# Altium project Inverter_Control.PrjPcb (part 1 of 4)
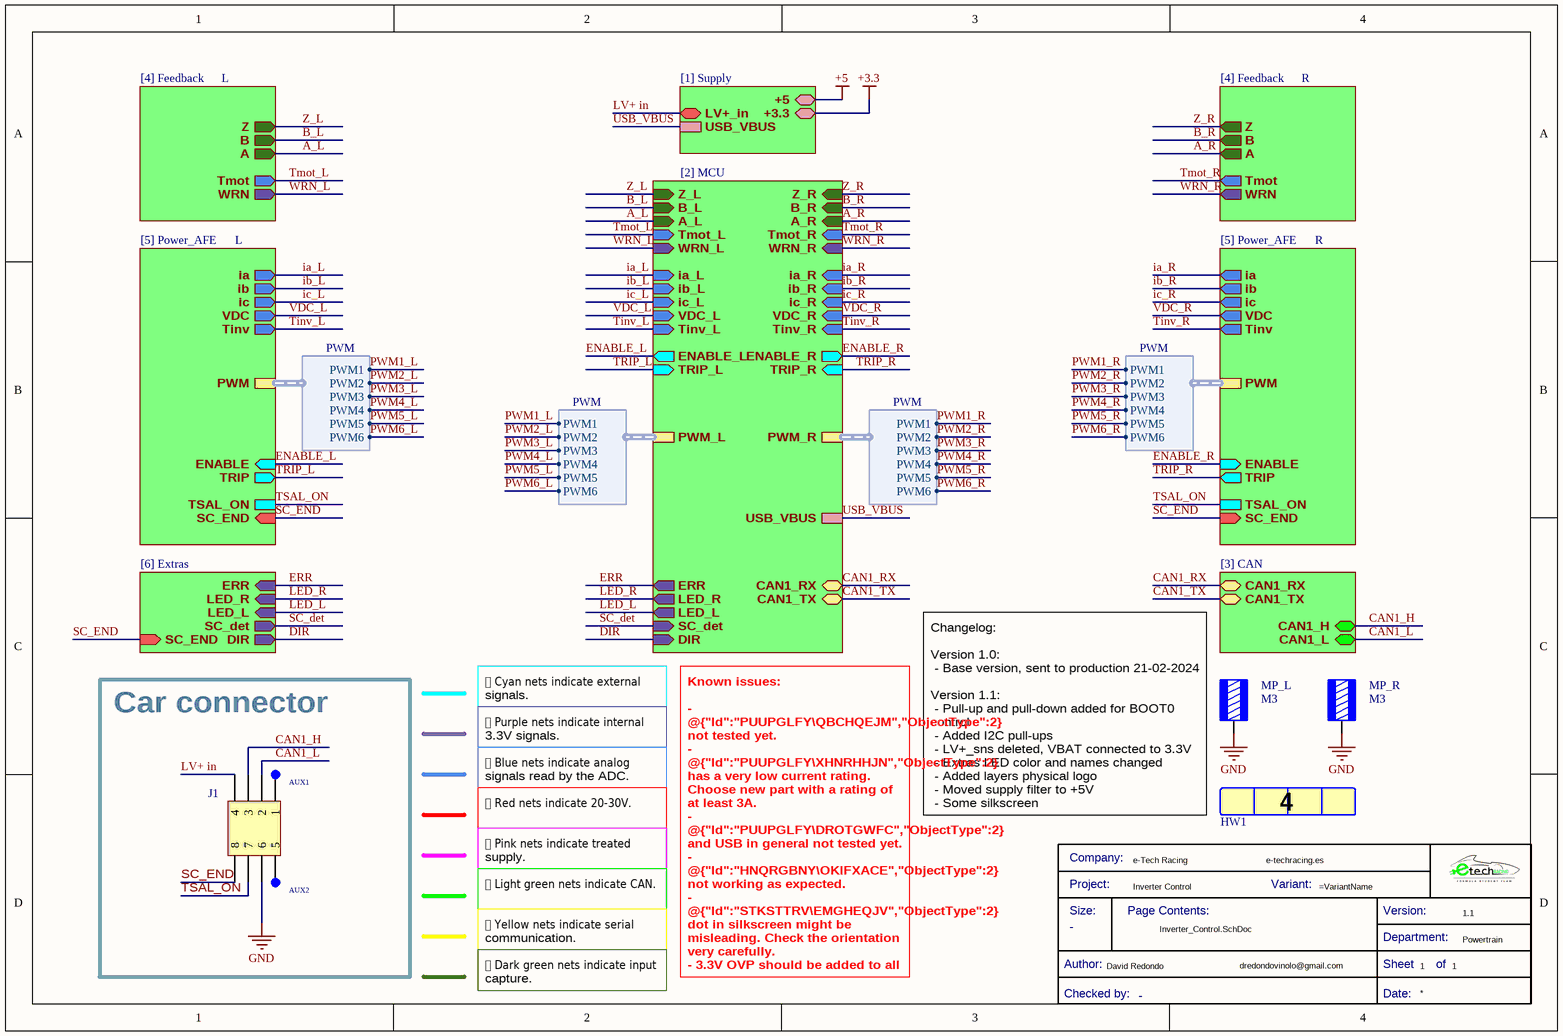
[diagram p0: Inverter_Control.SchDoc]
Company: e-Tech Racing; Department: Powertrain; DesignedByURL: e-techracing.es; DesignerMail: dredondovinolo@gmail.com; DesignerName: David Redondo; Project: Inverter Control; ReviewerName: -; Version: 1.1
7 sheets, 329 parts. Net scope: hierarchical (ports join the sheet entries above them; power ports are global).
Board file: Inverter_Control.PcbDoc
Sheets:
  Inverter_Control.SchDoc
    MCU = [2] MCU.SchDoc
    Supply = [1] Supply.SchDoc
    CAN = [3] CAN.SchDoc
    L = [4] Feedback.SchDoc
    R = [4] Feedback.SchDoc
    L = [5] Power_AFE.SchDoc
    Extras = [6] Extras.SchDoc
    R = [5] Power_AFE.SchDoc

## Sheet Inverter_Control.SchDoc
size A4; SheetNumber: 1; SheetTotal: 1

### Parts
(Parts that share a designator on the sheet are numbered #1, #2 ... from top to bottom, then left to right.)
*?#1  Title Block_template  (value not drawn)  (graphical)
AUX1  TestPoint  [TestPoint]  (value not drawn)  (no BOM)
AUX2  TestPoint  [TestPoint]  (value not drawn)  (no BOM)
HW1  LOGO CAPAS (4)  [LOGO_LAYERS_4]  (value not drawn)
J1  105310-1108  [J_NanoFit_2X4_V]  (value not drawn)
MP_L  M3  [7466313]
MP_R  M3  [7466313]

### Blocks framed on the sheet
Car connector: AUX1 AUX2 J1

### Sub-sheets
CAN = [3] CAN: CAN1_H (bidir), CAN1_L (bidir), CAN1_TX (bidir), CAN1_RX (bidir)
Extras = [6] Extras: LED_R (in), LED_L (in), DIR (out), ERR (in), SC_det (out), SC_END (in)
L = [4] Feedback: Tmot (out), WRN (out), A (out), B (out), Z (out)
L = [5] Power_AFE: TSAL_ON, SC_END (in), Tinv (out), ic (out), ib (out), ia (out), VDC (out), ENABLE (in), TRIP (out), PWM (harness PWM)
MCU = [2] MCU: Tinv_L (in), ic_L (in), ib_L (in), ia_L (in), VDC_L (in), ENABLE_L (out), TRIP_L (in), Tinv_R (in), ic_R (in), ib_R (in), ia_R (in), VDC_R (in), CAN1_RX (bidir), CAN1_TX (bidir), USB_VBUS, Tmot_L (in), WRN_L (in), Tmot_R (in), B_L (in), Z_L (in), A_R (in), B_R (in), Z_R (in), WRN_R (in), A_L (in), TRIP_R (in), PWM_L (harness PWM), PWM_R (harness PWM), LED_R (out), LED_L (out), DIR (in), ENABLE_R (out), ERR (out), SC_det (in)
R = [4] Feedback: Tmot (out), WRN (out), A (out), B (out), Z (out)
R = [5] Power_AFE: TSAL_ON, SC_END (in), Tinv (out), ic (out), ib (out), ia (out), VDC (out), ENABLE (in), TRIP (out), PWM (harness PWM)
Supply = [1] Supply: LV+_in (bidir), +5 (bidir), +3.3 (bidir), USB_VBUS

### Harnesses
PWM: PWM1, PWM2, PWM3, PWM4, PWM5, PWM6

### Nets
GND: J1.6 MP_L.1 MP_R.1
A_L: sheet MCU/A_L, sheet L/A  [project net A]
A_R: sheet MCU/A_R, sheet R/A  [project net A]
B_L: sheet MCU/B_L, sheet L/B  [project net B]
B_R: sheet MCU/B_R, sheet R/B  [project net B]
CAN1_H: J1.3 ; sheet CAN/CAN1_H
CAN1_L: J1.2 ; sheet CAN/CAN1_L
CAN1_RX: sheet MCU/CAN1_RX, sheet CAN/CAN1_RX
CAN1_TX: sheet MCU/CAN1_TX, sheet CAN/CAN1_TX
DIR: sheet MCU/DIR, sheet Extras/DIR
ENABLE_L: sheet MCU/ENABLE_L, sheet L/ENABLE  [project net ENABLE]
ENABLE_R: sheet MCU/ENABLE_R, sheet R/ENABLE  [project net ENABLE]
ERR: sheet MCU/ERR, sheet Extras/ERR
ia_L: sheet MCU/ia_L, sheet L/ia  [project net ia]
ia_R: sheet MCU/ia_R, sheet R/ia  [project net ia]
ib_L: sheet MCU/ib_L, sheet L/ib  [project net ib]
ib_R: sheet MCU/ib_R, sheet R/ib  [project net ib]
ic_L: sheet MCU/ic_L, sheet L/ic  [project net ic]
ic_R: sheet MCU/ic_R, sheet R/ic  [project net ic]
LED_L: sheet MCU/LED_L, sheet Extras/LED_L
LED_R: sheet MCU/LED_R, sheet Extras/LED_R
LV+ in: J1.4 ; sheet Supply/LV+_in
PWM1_L: sheet MCU/PWM_L.PWM1, sheet L/PWM.PWM1  [project net PWM1]
PWM1_R: sheet R/PWM.PWM1, sheet MCU/PWM_R.PWM1  [project net PWM1]
PWM2_L: sheet MCU/PWM_L.PWM2, sheet L/PWM.PWM2  [project net PWM2]
PWM2_R: sheet R/PWM.PWM2, sheet MCU/PWM_R.PWM2  [project net PWM2]
PWM3_L: sheet MCU/PWM_L.PWM3, sheet L/PWM.PWM3  [project net PWM3]
PWM3_R: sheet R/PWM.PWM3, sheet MCU/PWM_R.PWM3  [project net PWM3]
PWM4_L: sheet MCU/PWM_L.PWM4, sheet L/PWM.PWM4  [project net PWM4]
PWM4_R: sheet R/PWM.PWM4, sheet MCU/PWM_R.PWM4  [project net PWM4]
PWM5_L: sheet MCU/PWM_L.PWM5, sheet L/PWM.PWM5  [project net PWM5]
PWM5_R: sheet R/PWM.PWM5, sheet MCU/PWM_R.PWM5  [project net PWM5]
PWM6_L: sheet MCU/PWM_L.PWM6, sheet L/PWM.PWM6  [project net PWM6]
PWM6_R: sheet R/PWM.PWM6, sheet MCU/PWM_R.PWM6  [project net PWM6]
SC_det: sheet MCU/SC_det, sheet Extras/SC_det
SC_END: J1.8 ; sheet L/SC_END, sheet Extras/SC_END, sheet R/SC_END
Tinv_L: sheet MCU/Tinv_L, sheet L/Tinv  [project net Tinv]
Tinv_R: sheet MCU/Tinv_R, sheet R/Tinv  [project net Tinv]
Tmot_L: sheet MCU/Tmot_L, sheet L/Tmot  [project net Tmot]
Tmot_R: sheet MCU/Tmot_R, sheet R/Tmot  [project net Tmot]
TRIP_L: sheet MCU/TRIP_L, sheet L/TRIP  [project net TRIP]
TRIP_R: sheet MCU/TRIP_R, sheet R/TRIP  [project net TRIP]
TSAL_ON: J1.7 ; sheet L/TSAL_ON, sheet R/TSAL_ON
USB_VBUS: sheet MCU/USB_VBUS, sheet Supply/USB_VBUS
VDC_L: sheet MCU/VDC_L, sheet L/VDC  [project net VDC]
VDC_R: sheet MCU/VDC_R, sheet R/VDC  [project net VDC]
WRN_L: sheet MCU/WRN_L, sheet L/WRN  [project net WRN]
WRN_R: sheet MCU/WRN_R, sheet R/WRN  [project net WRN]
Z_L: sheet MCU/Z_L, sheet L/Z  [project net Z]
Z_R: sheet MCU/Z_R, sheet R/Z  [project net Z]
NetAUX1_1: AUX1.1(TP) J1.1
NetAUX2_1: AUX2.1(TP) J1.5

### Notes on the sheet
- ⓘ Cyan nets indicate external signals.
- ⓘ Purple nets indicate internal 3.3V signals.
- ⓘ Blue nets indicate analog signals read by the ADC.
- ⓘ Red nets indicate 20-30V.
- (near MP_L) Changelog:
  Version 1.0:
  - Base version, sent to production 21-02-2024
  Version 1.1:
  - Pull-up and pull-down added for BOOT0 control
  - Added I2C pull-ups
  - LV+_sns deleted, VBAT connected to 3.3V
  - Extras LED color and names changed
  - Added layers physical logo
  - Moved supply filter to +5V
  - Some silkscreen
- ⓘ Pink nets indicate treated supply.
- ⓘ Light green nets indicate CAN.
- ⓘ Yellow nets indicate serial communication.
- ⓘ Dark green nets indicate input capture.
- Known issues:
  - @{"Id":"PUUPGLFY\QBCHQEJM","ObjectType":2} not tested yet.
  - @{"Id":"PUUPGLFY\XHNRHHJN","ObjectType":2} has a very low current rating. Choose new part with a rating of at least 3A.
  - @{"Id":"PUUPGLFY\DROTGWFC","ObjectType":2} and USB in general not tested yet.
  - @{"Id":"HNQRGBNY\OKIFXACE","ObjectType":2} not working as expected.
  - @{"Id":"STKSTTRV\EMGHEQJV","ObjectType":2} dot in silkscreen might be misleading. Check the orientation very carefully.
  - 3.3V OVP should be added to all non-5V-tolerant MCU pins.
  - Most if not all 15R resistors could very well be 0R or solder bridges.
  - 10uF 50V 0805 caps are expensive and should be replaced with 10uF 50V 1206 or 10uF 50V 1210.
- (in symbol LOGO CAPAS) 4 Layers
- (in symbol Title Block_template) Company:; Project:; Variant:; Size:; Page Contents:; Version:; Department:; Author:; Sheet; of; Checked by:; Date:

### Library data of the parts
*?#1 = Title Block_template: Standard Title Block; .Creator: GP; Category: Title Block; .PCBcheck: GP; .SCHcheck: GP; Checked by:: -; Size: -
AUX1 AUX2 = TestPoint: Test Point 1x1 mm; .Creator: GP; Category: TestPoint; .PCBcheck: GP; .SCHcheck: GP
HW1 = LOGO CAPAS: Logo 4 capas; Id: 0074; Observations: Layers; Checked: False; Type: Logos; Supplier 1: Farnell; Supplier 2: Mouser; Supplier 3: RS; Supplier 4: Digi-Key; Author: Enric; Date: 22/06/2012
J1 = J_NanoFit_2x4_V: Nano-Fit Conn Power HDR 8 POS 2.5mm Solder ST Thru-Hole 8 Terminal 1 Port Nano-Fit™ Frame; Manufacturer: Molex; Supplier 1: RSComponents; Manufacturer Part Number: 105310-1108; RoHS: No; Category: Headers and Wire Housings; Stock 1: 1512; Pricing 1: 8=1,52500, 40=0,87900, 80=0,83600 (GBP); ComponentLink1URL: https://www.molex.com/pdm_docs/sd/1053101108_sd.pdf; ComponentLink1Description: Datasheet; ComponentLink2URL: https://www.molex.com/pdm_docs/ps/PS-105300-100-001.pdf?src-supplier=Digi-Key; ComponentLink2Description: https://www.molex.com/pdm_docs/ps/PS-105300-100-001.pdf?src-supplier=Digi-Key; ComponentLink3URL: http://www.farnell.com/datasheets/2551089.pdf?src-supplier=Newark; ComponentLink3Description: http://www.farnell.com/datasheets/2551089.pdf?src-supplier=Newark; Supplier Part Number 1: 1623685; ComponentLink4Description: Where buy it; ComponentLink4URL: https://www.molex.com/molex/products/part-detail/pcb_headers/1053101108
MP_L MP_R = 7466313: WP-SMRA REDCUBE SMT Right Angled with pins, M3, 50A; Manufacturer: Wurth Elektronik; Surface: Tin; ComponentLink1Description: Website Link; ComponentLink1URL: https://www.we-online.com/redexpert/article/7466313?ad; ComponentLink2Description: Datasheet Link; ComponentLink2URL: https://www.we-online.com/redexpert/spec/7466313?ad; Manufacturer Part Number: 7466313; Category: REDCUBE SMT; Match Code: WP-SMRA; Mount: Surface Mount; Operating Temperature Max: 150°C; Operating Temperature Min: -55°C; Packaging: Bulk; Height: 7mm; Material: Brass; Rated Current: 50A; Thread Size: M3

## Sheet [2] MCU.SchDoc
size A4
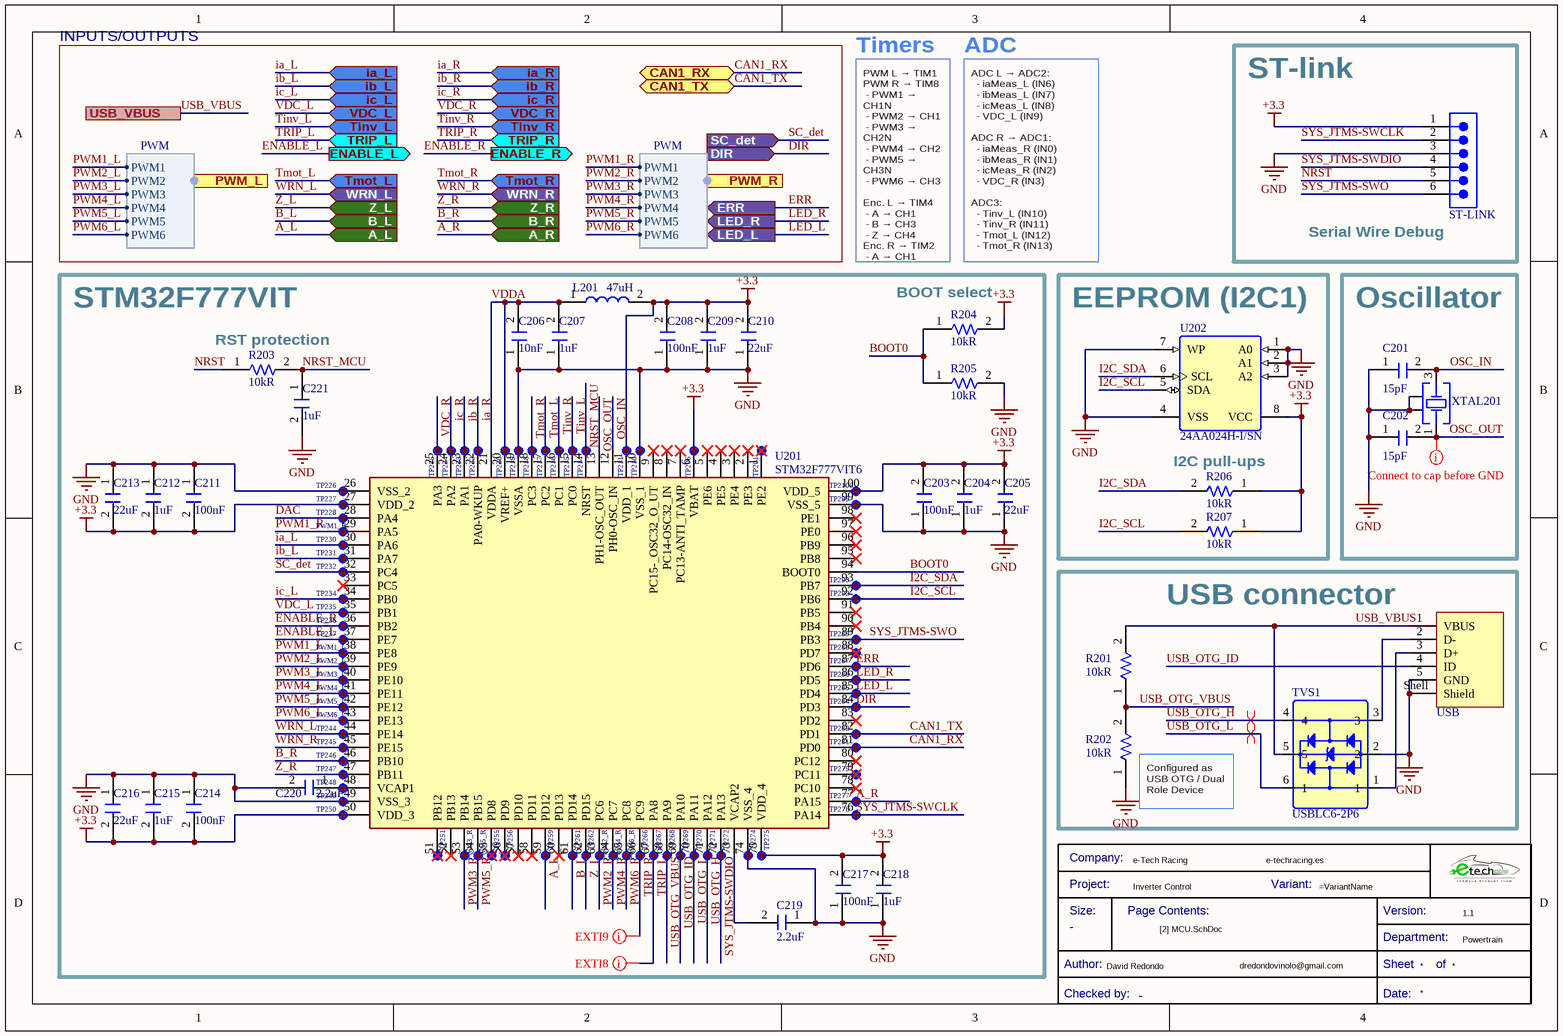
[diagram p1: [2] MCU.SchDoc]

### Parts
(Parts that share a designator on the sheet are numbered #1, #2 ... from top to bottom, then left to right.)
*?#2  Title Block_template  (value not drawn)  (graphical)
C201  Capacitance: 15pF  [C0805FNPC-R]  (hidden comment: 885012007052)
C202  Capacitance: 15pF  [C0805FNPC-R]  (hidden comment: 885012007052)
C203  Capacitance: 100nF  [C0805FNPC-R]  (hidden comment: 885012207098)
C204  Capacitance: 1uF  [C0805FNPC-R]  (hidden comment: 885012207103)
C205  Capacitance: 22uF  [C0805FNPC-W]  (hidden comment: 885012107011)
C206  Capacitance: 10nF  [C0805FNPC-R]  (hidden comment: 885012207092)
C207  Capacitance: 1uF  [C0805FNPC-R]  (hidden comment: 885012207103)
C208  Capacitance: 100nF  [C0805FNPC-R]  (hidden comment: 885012207098)
C209  Capacitance: 1uF  [C0805FNPC-R]  (hidden comment: 885012207103)
C210  Capacitance: 22uF  [C0805FNPC-W]  (hidden comment: 885012107011)
C211  Capacitance: 100nF  [C0805FNPC-R]  (hidden comment: 885012207098)
C212  Capacitance: 1uF  [C0805FNPC-R]  (hidden comment: 885012207103)
C213  Capacitance: 22uF  [C0805FNPC-W]  (hidden comment: 885012107011)
C214  Capacitance: 100nF  [C0805FNPC-R]  (hidden comment: 885012207098)
C215  Capacitance: 1uF  [C0805FNPC-R]  (hidden comment: 885012207103)
C216  Capacitance: 22uF  [C0805FNPC-W]  (hidden comment: 885012107011)
C217  Capacitance: 100nF  [C0805FNPC-R]  (hidden comment: 885012207098)
C218  Capacitance: 1uF  [C0805FNPC-R]  (hidden comment: 885012207103)
C219  2.2uF  [C0805FNPC-W]
C220  2.2uF  [C0805FNPC-W]
C221  Capacitance: 1uF  [C0805FNPC-R]  (hidden comment: 885012207103)
L201  Inductance: 47uH  [L47u-60mA_CF]  (hidden comment: 744764147)
PWM1_L  TestPoint  [TestPoint]  (value not drawn)  (no BOM)
PWM1_R  TestPoint  [TestPoint]  (value not drawn)  (no BOM)
PWM2_L  TestPoint  [TestPoint]  (value not drawn)  (no BOM)
PWM2_R  TestPoint  [TestPoint]  (value not drawn)  (no BOM)
PWM3_L  TestPoint  [TestPoint]  (value not drawn)  (no BOM)
PWM3_R  TestPoint  [TestPoint]  (value not drawn)  (no BOM)
PWM4_L  TestPoint  [TestPoint]  (value not drawn)  (no BOM)
PWM4_R  TestPoint  [TestPoint]  (value not drawn)  (no BOM)
PWM5_L  TestPoint  [TestPoint]  (value not drawn)  (no BOM)
PWM5_R  TestPoint  [TestPoint]  (value not drawn)  (no BOM)
PWM6_L  TestPoint  [TestPoint]  (value not drawn)  (no BOM)
PWM6_R  TestPoint  [TestPoint]  (value not drawn)  (no BOM)
R201  Resistance: 10kR  [R0805FTK]  (hidden comment: CR0805-JW-103ELF)
R202  Resistance: 10kR  [R0805FTK]  (hidden comment: CR0805-JW-103ELF)
R203  Resistance: 10kR  [R0805FTK]  (hidden comment: CR0805-JW-103ELF)
R204  Resistance: 10kR  [R0805FTK]  (hidden comment: CR0805-JW-103ELF)
R205  Resistance: 10kR  [R0805FTK]  (hidden comment: CR0805-JW-103ELF)
R206  Resistance: 10kR  [R0805FTK]  (hidden comment: CR0805-JW-103ELF)
R207  Resistance: 10kR  [R0805FTK]  (hidden comment: CR0805-JW-103ELF)
ST-LINK  61300611121  [61300611121]  (value not drawn)
TP201  TestPoint  [TestPoint]  (value not drawn)  (no BOM)
TP206  TestPoint  [TestPoint]  (value not drawn)  (no BOM)
TP210  TestPoint  [TestPoint]  (value not drawn)  (no BOM)
TP211  TestPoint  [TestPoint]  (value not drawn)  (no BOM)
TP214  TestPoint  [TestPoint]  (value not drawn)  (no BOM)
TP215  TestPoint  [TestPoint]  (value not drawn)  (no BOM)
TP216  TestPoint  [TestPoint]  (value not drawn)  (no BOM)
TP217  TestPoint  [TestPoint]  (value not drawn)  (no BOM)
TP218  TestPoint  [TestPoint]  (value not drawn)  (no BOM)
TP219  TestPoint  [TestPoint]  (value not drawn)  (no BOM)
TP220  TestPoint  [TestPoint]  (value not drawn)  (no BOM)
TP222  TestPoint  [TestPoint]  (value not drawn)  (no BOM)
TP223  TestPoint  [TestPoint]  (value not drawn)  (no BOM)
TP224  TestPoint  [TestPoint]  (value not drawn)  (no BOM)
TP225  TestPoint  [TestPoint]  (value not drawn)  (no BOM)
TP226  TestPoint  [TestPoint]  (value not drawn)  (no BOM)
TP227  TestPoint  [TestPoint]  (value not drawn)  (no BOM)
TP228  TestPoint  [TestPoint]  (value not drawn)  (no BOM)
TP230  TestPoint  [TestPoint]  (value not drawn)  (no BOM)
TP231  TestPoint  [TestPoint]  (value not drawn)  (no BOM)
TP232  TestPoint  [TestPoint]  (value not drawn)  (no BOM)
TP234  TestPoint  [TestPoint]  (value not drawn)  (no BOM)
TP235  TestPoint  [TestPoint]  (value not drawn)  (no BOM)
TP236  TestPoint  [TestPoint]  (value not drawn)  (no BOM)
TP237  TestPoint  [TestPoint]  (value not drawn)  (no BOM)
TP244  TestPoint  [TestPoint]  (value not drawn)  (no BOM)
TP245  TestPoint  [TestPoint]  (value not drawn)  (no BOM)
TP246  TestPoint  [TestPoint]  (value not drawn)  (no BOM)
TP247  TestPoint  [TestPoint]  (value not drawn)  (no BOM)
TP248  TestPoint  [TestPoint]  (value not drawn)  (no BOM)
TP249  TestPoint  [TestPoint]  (value not drawn)  (no BOM)
TP250  TestPoint  [TestPoint]  (value not drawn)  (no BOM)
TP251  TestPoint  [TestPoint]  (value not drawn)  (no BOM)
TP255  TestPoint  [TestPoint]  (value not drawn)  (no BOM)
TP256  TestPoint  [TestPoint]  (value not drawn)  (no BOM)
TP259  TestPoint  [TestPoint]  (value not drawn)  (no BOM)
TP261  TestPoint  [TestPoint]  (value not drawn)  (no BOM)
TP262  TestPoint  [TestPoint]  (value not drawn)  (no BOM)
TP266  TestPoint  [TestPoint]  (value not drawn)  (no BOM)
TP267  TestPoint  [TestPoint]  (value not drawn)  (no BOM)
TP268  TestPoint  [TestPoint]  (value not drawn)  (no BOM)
TP269  TestPoint  [TestPoint]  (value not drawn)  (no BOM)
TP270  TestPoint  [TestPoint]  (value not drawn)  (no BOM)
TP271  TestPoint  [TestPoint]  (value not drawn)  (no BOM)
TP272  TestPoint  [TestPoint]  (value not drawn)  (no BOM)
TP274  TestPoint  [TestPoint]  (value not drawn)  (no BOM)
TP275  TestPoint  [TestPoint]  (value not drawn)  (no BOM)
TP276  TestPoint  [TestPoint]  (value not drawn)  (no BOM)
TP277  TestPoint  [TestPoint]  (value not drawn)  (no BOM)
TP279  TestPoint  [TestPoint]  (value not drawn)  (no BOM)
TP281  TestPoint  [TestPoint]  (value not drawn)  (no BOM)
TP282  TestPoint  [TestPoint]  (value not drawn)  (no BOM)
TP284  TestPoint  [TestPoint]  (value not drawn)  (no BOM)
TP285  TestPoint  [TestPoint]  (value not drawn)  (no BOM)
TP286  TestPoint  [TestPoint]  (value not drawn)  (no BOM)
TP287  TestPoint  [TestPoint]  (value not drawn)  (no BOM)
TP288  TestPoint  [TestPoint]  (value not drawn)  (no BOM)
TP289  TestPoint  [TestPoint]  (value not drawn)  (no BOM)
TP292  TestPoint  [TestPoint]  (value not drawn)  (no BOM)
TP293  TestPoint  [TestPoint]  (value not drawn)  (no BOM)
TP299  TestPoint  [TestPoint]  (value not drawn)  (no BOM)
TP2100  TestPoint  [TestPoint]  (value not drawn)  (no BOM)
TVS1  USBLC6-2P6  [SOT50P160X60-6N]
U201  STM32F777VIT6  [QFP50P1600X1600X160-100N]
U202  24AA024H-I/SN  [SOIC, 8-Leads 1,27mm]
USB  629105136821  [629105136821]  (value not drawn)
XTAL201  20MHz  [WE-XTAL_CFPX-104]  (value not drawn)

### Blocks framed on the sheet
ST-link: ST-LINK
STM32F777VIT: C203-C221 L201 PWM1_L PWM1_R PWM2_L PWM2_R PWM3_L PWM3_R PWM4_L PWM4_R PWM5_L PWM5_R PWM6_L PWM6_R R203-R205 TP201 TP206 TP210 TP211 TP214-TP220 TP222-TP228 TP230-TP232 TP234-TP237 TP244-TP251 TP255 TP256 TP259 TP261 TP262 TP266-TP272 TP274-TP277 TP279 TP281 TP282 TP284-TP289 TP292 TP293 TP299 TP2100 U201
EEPROM (I2C1): R206 R207 U202
Oscillator: C201 C202 XTAL201
USB connector: R201 R202 TVS1 USB

### Ports
A_L (in), A_R (in), B_L (in), B_R (in), CAN1_RX (bidir), CAN1_TX (bidir), DIR (in), ENABLE_L (out), ENABLE_R (out), ERR (out), ia_L (in), ia_R (in), ib_L (in), ib_R (in), ic_L (in), ic_R (in), LED_L (out), LED_R (out), PWM_L (in, harness PWM), PWM_R (in, harness PWM), SC_det (in), Tinv_L (in), Tinv_R (in), Tmot_L (in), Tmot_R (in), TRIP_L (in), TRIP_R (in), USB_VBUS, VDC_L (in), VDC_R (in), WRN_L (in), WRN_R (in), Z_L (in), Z_R (in)

### Harnesses
PWM: PWM1, PWM2, PWM3, PWM4, PWM5, PWM6

### Nets
+3.3: C203.2 C204.2 C205.2 C208.2 C209.2 C210.2 C211.2 C212.2 C213.2 C214.2 C215.2 C216.2 C217.2 C218.2 L201.2 R204.2 R206.1 R207.1 ST-LINK.1 TP206.1(TP) TP211.1(TP) TP227.1(TP) TP250.1(TP) TP275.1(TP) TP2100.1(TP) U201.6(VBAT) U201.11(VDD_1) U201.27(VDD_2) U201.50(VDD_3) U201.75(VDD_4) U201.100(VDD_5) U202.8(VCC)
GND: C201.1 C202.1 C203.1 C204.1 C205.1 C206.1 C207.1 C208.1 C209.1 C210.1 C211.1 C212.1 C213.1 C214.1 C215.1 C216.1 C217.1 C218.1 C219.1 C220.2 C221.2 R202.1 R205.2 ST-LINK.3 TP210.1(TP) TP219.1(TP) TP226.1(TP) TP249.1(TP) TP274.1(TP) TP299.1(TP) TVS1.2 U201.10(VSS_1) U201.19(VSSA) U201.26(VSS_2) U201.49(VSS_3) U201.74(VSS_4) U201.99(VSS_5) U202.1(A0) U202.2(A1) U202.3(A2) U202.4(VSS) U202.7(WP) USB.5(GND) USB.Shell(Shield) XTAL201.2(GND_&_Lid) XTAL201.4(GND_&_Lid)
A_L: TP259.1(TP) U201.59(PD12) ; port A_L  [project net A]
A_R: TP277.1(TP) U201.77(PA15) ; port A_R  [project net A]
B_L: TP261.1(TP) U201.61(PD14) ; port B_L  [project net B]
B_R: TP246.1(TP) U201.46(PB10) ; port B_R  [project net B]
BOOT0: R204.1 R205.1 U201.94(BOOT0)
CAN1_RX: TP281.1(TP) U201.81(PD0) ; port CAN1_RX
CAN1_TX: TP282.1(TP) U201.82(PD1) ; port CAN1_TX
DAC: TP228.1(TP) U201.28(PA4)
DIR: TP284.1(TP) U201.84(PD3) ; port DIR
ENABLE_L: TP237.1(TP) U201.37(PE7) ; port ENABLE_L  [project net ENABLE]
ENABLE_R: TP236.1(TP) U201.36(PB2) ; port ENABLE_R  [project net ENABLE]
ERR: TP287.1(TP) U201.87(PD6) ; port ERR
I2C_SCL: R207.2 TP292.1(TP) U201.92(PB6) U202.5(SDA)
I2C_SDA: R206.2 TP293.1(TP) U201.93(PB7) U202.6(SCL)
ia_L: TP230.1(TP) U201.30(PA6) ; port ia_L  [project net ia]
ia_R: TP222.1(TP) U201.22(PA0-WKUP) ; port ia_R  [project net ia]
ib_L: TP231.1(TP) U201.31(PA7) ; port ib_L  [project net ib]
ib_R: TP223.1(TP) U201.23(PA1) ; port ib_R  [project net ib]
ic_L: TP234.1(TP) U201.34(PB0) ; port ic_L  [project net ic]
ic_R: TP224.1(TP) U201.24(PA2) ; port ic_R  [project net ic]
LED_L: TP285.1(TP) U201.85(PD4) ; port LED_L
LED_R: TP286.1(TP) U201.86(PD5) ; port LED_R
NRST: R203.1 ST-LINK.5
NRST_MCU: C221.1 R203.2 TP214.1(TP) U201.14(NRST)
OSC_IN: C201.2 U201.12(PH0-OSC_IN) XTAL201.3(Crystal)
OSC_OUT: C202.2 U201.13(PH1-OSC_OUT) XTAL201.1(Crystal)
PWM1_L: PWM1_L.1(TP) U201.38(PE8) ; port PWM_L.PWM1  [project net PWM1]
PWM1_R: PWM1_R.1(TP) U201.29(PA5) ; port PWM_R.PWM1  [project net PWM1]
PWM2_L: PWM2_L.1(TP) U201.39(PE9) ; port PWM_L.PWM2  [project net PWM2]
PWM2_R: PWM2_R.1(TP) U201.63(PC6) ; port PWM_R.PWM2  [project net PWM2]
PWM3_L: PWM3_L.1(TP) U201.40(PE10) ; port PWM_L.PWM3  [project net PWM3]
PWM3_R: PWM3_R.1(TP) U201.53(PB14) ; port PWM_R.PWM3  [project net PWM3]
PWM4_L: PWM4_L.1(TP) U201.41(PE11) ; port PWM_L.PWM4  [project net PWM4]
PWM4_R: PWM4_R.1(TP) U201.64(PC7) ; port PWM_R.PWM4  [project net PWM4]
PWM5_L: PWM5_L.1(TP) U201.42(PE12) ; port PWM_L.PWM5  [project net PWM5]
PWM5_R: PWM5_R.1(TP) U201.54(PB15) ; port PWM_R.PWM5  [project net PWM5]
PWM6_L: PWM6_L.1(TP) U201.43(PE13) ; port PWM_L.PWM6  [project net PWM6]
PWM6_R: PWM6_R.1(TP) U201.65(PC8) ; port PWM_R.PWM6  [project net PWM6]
SC_det: TP232.1(TP) U201.32(PC4) ; port SC_det
SYS_JTMS-SWCLK: ST-LINK.2 TP276.1(TP) U201.76(PA14)
SYS_JTMS-SWDIO: ST-LINK.4 TP272.1(TP) U201.72(PA13)
SYS_JTMS-SWO: ST-LINK.6 TP289.1(TP) U201.89(PB3)
Tinv_L: TP215.1(TP) U201.15(PC0) ; port Tinv_L  [project net Tinv]
Tinv_R: TP216.1(TP) U201.16(PC1) ; port Tinv_R  [project net Tinv]
Tmot_L: TP217.1(TP) U201.17(PC2) ; port Tmot_L  [project net Tmot]
Tmot_R: TP218.1(TP) U201.18(PC3) ; port Tmot_R  [project net Tmot]
TRIP_L: TP267.1(TP) U201.67(PA8) ; port TRIP_L  [project net TRIP]
TRIP_R: TP266.1(TP) U201.66(PC9) ; port TRIP_R  [project net TRIP]
USB_OTG_H: TP271.1(TP) TVS1.4 U201.71(PA12)
USB_OTG_ID: TP269.1(TP) U201.69(PA10) USB.4(ID)
USB_OTG_L: TP270.1(TP) TVS1.6(1) U201.70(PA11)
USB_OTG_VBUS: R201.1 R202.2 TP268.1(TP) U201.68(PA9)
USB_VBUS: R201.2 TVS1.5 USB.1(VBUS) ; port USB_VBUS
VDC_L: TP235.1(TP) U201.35(PB1) ; port VDC_L  [project net VDC]
VDC_R: TP225.1(TP) U201.25(PA3) ; port VDC_R  [project net VDC]
VDDA: C206.2 C207.2 L201.1 TP220.1(TP) U201.20(VREF+) U201.21(VDDA)
WRN_L: TP244.1(TP) U201.44(PE14) ; port WRN_L  [project net WRN]
WRN_R: TP245.1(TP) U201.45(PE15) ; port WRN_R  [project net WRN]
Z_L: TP262.1(TP) U201.62(PD15) ; port Z_L  [project net Z]
Z_R: TP247.1(TP) U201.47(PB11) ; port Z_R  [project net Z]
NetC219_2: C219.2 U201.73(VCAP2)
NetC220_1: C220.1 TP248.1(TP) U201.48(VCAP1)
NetTP201_1: TP201.1(TP) U201.1(PE2)
NetTP251_1: TP251.1(TP) U201.51(PB12)
NetTP255_1: TP255.1(TP) U201.55(PD8)
NetTP256_1: TP256.1(TP) U201.56(PD9)
NetTP279_1: TP279.1(TP) U201.79(PC11)
NetTP288_1: TP288.1(TP) U201.88(PD7)
NetTVS1_1: TVS1.1 USB.3(D+)
NetTVS1_3: TVS1.3 USB.2(D-)

Not connected (* = marked no-connect by the designer): U201 2(PE3)* 3(PE4)* 4(PE5)* 5(PE6)* 7(PC13-ANTI_TAMP)* 8(PC14-OSC32_IN)* 9(PC15-_OSC32_O_UT)* 33(PC5)* 52(PB13)* 57(PD10)* 58(PD11)* 60(PD13)* 78(PC10)* 80(PC12)* 83(PD2)* 90(PB4)* 91(PB5)* 95(PB8)* 96(PB9)* 97(PE0)* 98(PE1)*

### Layout directives
differential pair: USB_OTG_H, USB_OTG_L
mark named EXTI8: TRIP
mark named EXTI9: TRIP
mark named Connect to cap before GND: OSC_OUT

### Notes on the sheet
- INPUTS/OUTPUTS
- Timers
- ADC
- (near ST-LINK) Serial Wire Debug
- PWM L → TIM1
  PWM R → TIM8
  - PWM1 → CH1N
  - PWM2 → CH1
  - PWM3 → CH2N
  - PWM4 → CH2
  - PWM5 → CH3N
  - PWM6 → CH3
  Enc. L → TIM4
  - A → CH1
  - B → CH3
  - Z → CH4
  Enc. R → TIM2
  - A → CH1
  - B → CH3
  - Z → CH4
- (near R204) BOOT select
- ADC L → ADC2:
  - iaMeas_L (IN6)
  - ibMeas_L (IN7)
  - icMeas_L (IN8)
  - VDC_L (IN9)
  ADC R → ADC1:
  - iaMeas_R (IN0)
  - ibMeas_R (IN1)
  - icMeas_R (IN2)
  - VDC_R (IN3)
  ADC3:
  - Tinv_L (IN10)
  - Tinv_R (IN11)
  - Tmot_L (IN12)
  - Tmot_R (IN13)
- (near R203) RST protection
- (near R206) I2C pull-ups
- (near R202) Configured as USB OTG / Dual Role Device
- (in symbol Title Block_template) Company:; Project:; Variant:; Size:; Page Contents:; Version:; Department:; Author:; Sheet; of; Checked by:; Date:

### Library data of the parts
*?#2 = Title Block_template: Standard Title Block; .Creator: GP; Category: Title Block; .PCBcheck: GP; .SCHcheck: GP; Checked by:: -; Size: -
C201 C202 = C15p-50V-0805FNPC-NP0: Cap, 15PF, 50V, 5%, C0G/NP0, 0805; Manufacturer 1: Wurth Electronics; .Creator: DR; Supplier 1: Newark; Manufacturer Part Number 1: 885012007052; RoHS: Yes; Category: Ceramic Capacitors; Stock 1: 815; Pricing 1: 1=0,10800, 10=0,05200, 25=0,05100, 50=0,04900, 100=0,04800, 250=0,04600, 500=0,04300 (USD); Mount: Surface Mount; Case/Package: 0805; Case Code (Metric): 2012; Case Code (Imperial): 0805; Min Operating Temperature: -55°C; Max Operating Temperature: 125°C; Packaging: Cut Tape; Voltage Rating: 50V; Tolerance: 5%; Length: 0.079inch; Width: 0.049inch; Thickness: 0.028inch; RoHS Compliant: Yes; ComponentLink1URL: http://www.farnell.com/datasheets/2031702.pdf?src-supplier=Farnell; ComponentLink1Description: http://www.farnell.com/datasheets/2031702.pdf?src-supplier=Farnell; ComponentLink2URL: http://katalog.we-online.de/pbs/datasheet/885012007052.pdf?src-supplier=Digi-Key; ComponentLink2Description: http://katalog.we-online.de/pbs/datasheet/885012007052.pdf?src-supplier=Digi-Key; ComponentLink3URL: https://katalog.we-online.de/pbs/datasheet/885012007052.pdf?src-supplier=Digi-Key; ComponentLink3Description: https://katalog.we-online.de/pbs/datasheet/885012007052.pdf?src-supplier=Digi-Key; Supplier Part Number 1: 15AC9316
C203 C208 C211 C214 C217 = C100n-50V-0805FNPC-X7R: Cap, 0.1ΜF, 50V, 10%, X7R, 0805; Manufacturer 1: Wurth Electronics; .Creator: DR; Supplier 1: RSComponents; Manufacturer Part Number 1: 885012207098; RoHS: Yes; Category: Ceramic Capacitors; Stock 1: 8000; Pricing 1: 100=0,10200, 500=0,07100, 2000=0,06100 (GBP); Mount: Surface Mount; Case/Package: 0805; Case Code (Metric): 2012; Case Code (Imperial): 0805; Min Operating Temperature: -55°C; Max Operating Temperature: 125°C; Packaging: Cut Tape; Voltage Rating: 50V; Dielectric: X7R; Tolerance: 10%; Voltage Rating (DC): 50V; Length: 0.079inch; Width: 0.049inch; Thickness: 0.035inch; REACH SVHC: Unknown; RoHS Compliant: Yes; ComponentLink1URL: http://www.farnell.com/datasheets/1958498.pdf?src-supplier=Farnell; ComponentLink1Description: http://www.farnell.com/datasheets/1958498.pdf?src-supplier=Farnell; ComponentLink2URL: http://www.farnell.com/datasheets/1958498.pdf?src-supplier=Element14; ComponentLink2Description: http://www.farnell.com/datasheets/1958498.pdf?src-supplier=Element14; ComponentLink3URL: https://katalog.we-online.de/pbs/datasheet/885012207098.pdf?src-supplier=Digi-Key; ComponentLink3Description: https://katalog.we-online.de/pbs/datasheet/885012207098.pdf?src-supplier=Digi-Key; ComponentLink4URL: http://www.farnell.com/datasheets/1958498.pdf?src-supplier=Newark; ComponentLink4Description: http://www.farnell.com/datasheets/1958498.pdf?src-supplier=Newark; Supplier Part Number 1: 1813493
C204 C207 C209 C212 C215 C218 C221 = C1u-50V-0805FNPC-X7R: Multilayer Ceramic Capacitor, Wcap-Csgp Series, 1 F, 10%, X7R, 50 V, 0805 [2012 Metric] Rohs Compliant: Yes; Manufacturer 1: Wurth Electronics; Voltage Rating: 50V; .Creator: GP; Supplier 1: RSComponents; Manufacturer Part Number 1: 885012207103; RoHS: Yes; Category: Ceramic Capacitors; Stock 1: 5100; Pricing 1: 50=0,27200, 250=0,25300, 500=0,22800, 1250=0,20100, 2500=0,17100 (GBP); Mount: Surface Mount; Case/Package: 0805; Case Code (Metric): 2012; Case Code (Imperial): 0805; Min Operating Temperature: -55°C; Max Operating Temperature: 85°C; Packaging: Cut Tape; Dielectric: X7R; Tolerance: 10%; Voltage Rating (DC): 50V; Length: 0.079inch; Width: 0.049inch; Thickness: 0.053inch; REACH SVHC: Unknown; RoHS Compliant: Yes; ComponentLink1URL: http://www.farnell.com/datasheets/1958501.pdf?src-supplier=Farnell; ComponentLink1Description: http://www.farnell.com/datasheets/1958501.pdf?src-supplier=Farnell; ComponentLink2URL: http://www.farnell.com/datasheets/1958501.pdf?src-supplier=Element14; ComponentLink2Description: http://www.farnell.com/datasheets/1958501.pdf?src-supplier=Element14; ComponentLink3URL: https://katalog.we-online.de/pbs/datasheet/885012107003.pdf?src-supplier=Digi-Key; ComponentLink3Description: https://katalog.we-online.de/pbs/datasheet/885012107003.pdf?src-supplier=Digi-Key; ComponentLink4URL: http://www.farnell.com/datasheets/1958501.pdf?src-supplier=Newark; ComponentLink4Description: http://www.farnell.com/datasheets/1958501.pdf?src-supplier=Newark; Supplier Part Number 1: 1813523
C205 C210 C213 C216 = C22u-10V-0805FNPC-X5R: Multilayer Ceramic Capacitor, Wcap-Csgp Series, 22 F, 20%, X5R, 10 V, 0805 [2012 Metric] Rohs Compliant: Yes; Manufacturer: Wurth Electronics; Voltage Rating: 10V; .Creator: DR; Supplier 1: RSComponents; Manufacturer Part Number: 885012107011; RoHS: Yes; Category: Ceramic Capacitors; Stock 1: 8800; Pricing 1: 20=0,15300, 100=0,40300, 200=0,37700, 500=0,35100, 1000=0,31700 (GBP); Mount: Surface Mount; Case/Package: 0805; Case Code (Metric): 2012; Case Code (Imperial): 0805; Min Operating Temperature: -55°C; Max Operating Temperature: 85°C; Packaging: Cut Tape; Dielectric: X5R; Tolerance: 20%; Voltage Rating (DC): 10V; Length: 0.079inch; Width: 0.049inch; Thickness: 0.057inch; REACH SVHC: Unknown; RoHS Compliant: Yes; ComponentLink1URL: http://www.farnell.com/datasheets/1958453.pdf?src-supplier=Farnell; ComponentLink1Description: http://www.farnell.com/datasheets/1958453.pdf?src-supplier=Farnell; ComponentLink2URL: http://www.farnell.com/datasheets/1958453.pdf?src-supplier=Newark; ComponentLink2Description: http://www.farnell.com/datasheets/1958453.pdf?src-supplier=Newark; ComponentLink3URL: http://www.farnell.com/datasheets/1958453.pdf?src-supplier=Element14; ComponentLink3Description: http://www.farnell.com/datasheets/1958453.pdf?src-supplier=Element14; ComponentLink4URL: https://katalog.we-online.de/pbs/datasheet/885012107011.pdf?src-supplier=Digi-Key; ComponentLink4Description: https://katalog.we-online.de/pbs/datasheet/885012107011.pdf?src-supplier=Digi-Key; Supplier Part Number 1: 1813507; ComponentLink5Description: Where buy it; ComponentLink5URL: https://www.we-online.com/catalog/en/WCAP-CSGP-10VDC#885012107011
C206 = C10n-50V-0805FNPC-X7R: Cap, 0.01ΜF, 50V, 10%, X7R, 0805; Manufacturer 1: Wurth Electronics; .Creator: DR; Supplier 1: RSComponents; Manufacturer Part Number 1: 885012207092; RoHS: Yes; Category: Ceramic Capacitors; Stock 1: 1; Pricing 1: 4000=0,03200, 12000=0,03100 (USD); Mount: Surface Mount; Case/Package: 0805; Case Code (Metric): 2012; Case Code (Imperial): 0805; Min Operating Temperature: -55°C; Max Operating Temperature: 125°C; Packaging: Cut Tape; Voltage Rating: 50V; Dielectric: X7R; Tolerance: 10%; Voltage Rating (DC): 50V; Length: 0.079inch; Width: 0.049inch; Thickness: 0.035inch; REACH SVHC: Unknown; RoHS Compliant: Yes; ComponentLink1URL: http://www.farnell.com/datasheets/1958497.pdf?src-supplier=Farnell; ComponentLink1Description: http://www.farnell.com/datasheets/1958497.pdf?src-supplier=Farnell; ComponentLink2URL: http://www.farnell.com/datasheets/1958497.pdf?src-supplier=Element14; ComponentLink2Description: http://www.farnell.com/datasheets/1958497.pdf?src-supplier=Element14; ComponentLink3URL: http://www.farnell.com/datasheets/1958497.pdf?src-supplier=Newark; ComponentLink3Description: http://www.farnell.com/datasheets/1958497.pdf?src-supplier=Newark; ComponentLink4URL: https://katalog.we-online.de/pbs/datasheet/885012207092.pdf?src-supplier=Digi-Key; ComponentLink4Description: https://katalog.we-online.de/pbs/datasheet/885012207092.pdf?src-supplier=Digi-Key; Supplier Part Number 1: 1813941
C219 C220 = C2.2u-16V-0805FTK
L201 = L47u-60mA_CF: WE-GF Series; Wire-wound SMD Inductor with Ferrite Core; 47 µH; Manufacturer 1: Wurth Electronics; Tolerance: 10%; Max DC Current: 60mA; DC Resistance (DCR): 7R; Self Resonant Frequency: 15MHz; .Creator: GP; Supplier 1: Digi-Key; Manufacturer Part Number 1: 744764147; RoHS: Yes; Category: Fixed Inductors; Stock 1: 156; Pricing 1: 1=0,66000, 10=0,59500, 50=0,54800, 100=0,51200, 500=0,46500 (USD); Mount: Surface Mount; Case/Package: 1210; Core Material: Ferrite; Min Operating Temperature: -40°C; Max Operating Temperature: 105°C; Packaging: Cut Tape; Inductance Tolerance: 10%; Series: WE-GF; Length: 3.2mm; Height: 2.2mm; Depth: 2.5mm; REACH SVHC: Unknown; RoHS Compliant: Yes; ComponentLink1URL: https://datasheet.ciiva.com/11801/0900766b802e95df-11801953.pdf?src-supplier=RSComponents; ComponentLink1Description: https://datasheet.ciiva.com/11801/0900766b802e95df-11801953.pdf?src-supplier=RSComponents; Supplier Part Number 1: 732-14034-1-ND; ComponentLink2Description: Wurth Elektronik; ComponentLink2URL: https://www.we-online.com/catalog/en/WE-GF?sq=744764147&sp=https%3A%2F%2Fwww.we-online.com%2Fweb%2Fen%2Fwuerth_elektronik%2Fsearchpage.php%3Fsearch%3D744764147#744764147
PWM1_L PWM1_R PWM2_L PWM2_R PWM3_L PWM3_R PWM4_L PWM4_R PWM5_L PWM5_R PWM6_L PWM6_R TP201 TP206 TP210 TP211 TP214-TP220 TP222-TP228 TP230-TP232 TP234-TP237 TP244-TP251 TP255 TP256 TP259 TP261 TP262 TP266-TP272 TP274-TP277 TP279 TP281 TP282 TP284-TP289 TP292 TP293 TP299 TP2100 = TestPoint: Test Point 1x1 mm; .Creator: GP; Category: TestPoint; .PCBcheck: GP; .SCHcheck: GP
R201-R207 = R10k-0805FTK: BOURNS         CR0805-JW-103ELF            Surface Mount Chip Resistor, Thick Film, CR Series, 10 kohm, 125 mW,  5%, 150 V; Temperature Coefficient: 200ppm/°C; Power Rating: 125mW; Voltage Rating: 150V; Voltage Rating (DC): 100V; .Creator: DR; Supplier 1: Arrow Electronics; Manufacturer 1: Bourns; Manufacturer Part Number 1: CR0805-JW-103ELF; RoHS: Yes; Category: Chip SMD Resistors; Stock 1: 57566; Pricing 1: 1=0,05790, 10=0,01540, 25=0,01340, 100=0,00340 (USD); Mount: Surface Mount; Case/Package: 0805; Number of Pins: 2; Contact Plating: Tin; Case Code (Metric): 2012; Case Code (Imperial): 0805; Min Operating Temperature: -55°C; Max Operating Temperature: 155°C; Tolerance: 5%; Resistor Type: Thick Film; Package Quantity: 1; Packaging: Tape and Reel; Number of Terminations: 2; Termination: SMD/SMT; Max Power Dissipation: 125mW; Features: Moisture Resistant; Series: CR0805; Construction: Rectangular; Resistance Tolerance: 5%; Technology: THICK FILM; Length: 2mm; Width: 1.25mm; Height: 0.5mm; Depth: 1.25mm; Thickness: 508um; Radiation Hardening: No; REACH SVHC: No SVHC; Military Standard: Not; RoHS Compliant: Yes; ComponentLink1URL: https://datasheet.ciiva.com/11821/0900766b80fcdb72-11821135.pdf?src-supplier=RSComponents; ComponentLink1Description: https://datasheet.ciiva.com/11821/0900766b80fcdb72-11821135.pdf?src-supplier=RSComponents; ComponentLink2URL: https://datasheet.ciiva.com/9122/chpreztr-9122374.pdf?src-supplier=Avnet; ComponentLink2Description: https://datasheet.ciiva.com/9122/chpreztr-9122374.pdf?src-supplier=Avnet; ComponentLink3URL: https://datasheet.ciiva.com/22693/1902866-22693254.pdf?src-supplier=Element14; ComponentLink3Description: https://datasheet.ciiva.com/22693/1902866-22693254.pdf?src-supplier=Element14; ComponentLink4URL: https://datasheet.ciiva.com/7986/691949-7986187.pdf?src-supplier=Element14; ComponentLink4Description: https://datasheet.ciiva.com/7986/691949-7986187.pdf?src-supplier=Element14; ComponentLink5URL: https://datasheet.ciiva.com/30065/159chpreztr-30065976.pdf?src-supplier=Onlinecomponents.com; ComponentLink5Description: https://datasheet.ciiva.com/30065/159chpreztr-30065976.pdf?src-supplier=Onlinecomponents.com; ComponentLink6URL: https://datasheet.ciiva.com/16783/70154685-16783482.pdf?src-supplier=Allied+Electronics; ComponentLink6Description: https://datasheet.ciiva.com/16783/70154685-16783482.pdf?src-supplier=Allied+Electronics; ComponentLink7URL: https://datasheet.ciiva.com/5548/chpreztr-5548491.pdf?src-supplier=Mouser; ComponentLink7Description: https://datasheet.ciiva.com/5548/chpreztr-5548491.pdf?src-supplier=Mouser; ComponentLink8URL: https://datasheet.ciiva.com/6559/chpreztr-6559900.pdf?src-supplier=Digi-Key; ComponentLink8Description: https://datasheet.ciiva.com/6559/chpreztr-6559900.pdf?src-supplier=Digi-Key; ComponentLink9URL: https://datasheet.ciiva.com/6559/chpreztr-6559901.pdf?src-supplier=Digi-Key; ComponentLink9Description: https://datasheet.ciiva.com/6559/chpreztr-6559901.pdf?src-supplier=Digi-Key; ComponentLink10URL: https://datasheet.ciiva.com/7985/1856384-7985869.pdf?src-supplier=Element14; ComponentLink10Description: https://datasheet.ciiva.com/7985/1856384-7985869.pdf?src-supplier=Element14; ComponentLink11URL: https://datasheet.ciiva.com/48692/001055517-da-01-en-smd-wid-cr0805-jw-103elf-10k-ohm-1-8w-48692118.pdf?src-supplier=Conrad; ComponentLink11Description: https://datasheet.ciiva.com/48692/001055517-da-01-en-smd-wid-cr0805-jw-103elf-10k-ohm-1-8w-48692118.pdf?src-supplier=Conrad; Supplier Part Number 1: CR0805-JW-103ELF
ST-LINK = 61300611121: WR-PHD Pin Header, THT, Vertical, pitch 2.54mm, 1 Row, 6P; Manufacturer: Wurth Elektronik; Contact Resistance: 20mOhm; Rated Current: 3A; Working Voltage: 250V; Withstanding Voltage: 500V; Manufacturer Part Number: 61300611121; Category: Board-to-Board Connectors; Match Code: WR-PHD; ComponentLink1Description: Website Link; ComponentLink1URL: https://www.we-online.com/redexpert/article/61300611121?ad; ComponentLink2Description: Datasheet Link; ComponentLink2URL: https://www.we-online.com/redexpert/spec/61300611121?ad; Mount: Through Hole; Operating Temperature Max: 105°C; Operating Temperature Min: -40°C; Packaging: Bag; Gender: Pin Header; Number of Pins: 6; Number of Rows: 1; Orientation: Vertical; Pitch: 2.54mm
U201 = STM32F777VIT6: ARM Microcontrollers - MCU 16/32-BITS MICROS; Manufacturer_Name: STMicroelectronics; Geometry.Height: 1.6mm; Mouser Part Number: 511-STM32F777VIT6; Mouser Price/Stock: https://www.mouser.co.uk/ProductDetail/STMicroelectronics/STM32F777VIT6?qs=qzCNEk%252BRr%252BbclRoyC9pexg%3D%3D; Manufacturer_Part_Number: STM32F777VIT6; Datasheet Link: https://www.st.com/resource/en/datasheet/stm32f777vi.pdf; Supplier 1: Mouser; Supplier Part Number 1: 511-STM32F777VIT6
U202 = EEPROM 24AA024H-I/SN: 2Kb I2C Serial EEPROM with Address Inputs and Half-Array Write Protection
USB = 629105136821: WR-COM Micro USB 2.0 SMT Type B Horizontal 5 Contacts; Manufacturer: Wurth Elektronik; Match Code: WR-USB; Gender: Receptacle; Interface Type: Type B; Number of Ports: 1; Rated Current: 1A; Working Voltage: 30V (AC); Manufacturer Part Number: 629105136821; Category: Input/Output Connectors; ComponentLink1Description: Website Link; ComponentLink1URL: https://www.we-online.com/redexpert/article/629105136821?ad; ComponentLink2Description: Datasheet Link; ComponentLink2URL: https://www.we-online.com/redexpert/spec/629105136821?ad; Mount: Surface Mount; Operating Temperature Max: 105°C; Operating Temperature Min: -40°C; Packaging: Tape and Reel; Application: Micro USB 2.0; Number of Pins: 5; Orientation: Horizontal; Supplier 1: Rs; Supplier Part Number 1: 8183361
XTAL201 = 830056808: WE-XTAL Quartz Crystal, SMT, CFPX-104, 20MHz, +/-20ppm; Manufacturer: Wurth Elektronik; Frequency Stability: +/-30ppm; Load Capacitance: 18pF; ComponentLink1Description: Website Link; ComponentLink1URL: https://www.we-online.com/redexpert/article/830056808?ad; ComponentLink2Description: Datasheet Link; ComponentLink2URL: https://www.we-online.com/redexpert/spec/830056808?ad; Manufacturer Part Number: 830056808; Category: Crystals; Match Code: WE-XTAL; Mount: Surface Mount; Operating Temperature Max: 85°C; Operating Temperature Min: -40°C; Packaging: Tape and Reel; Case/Size Code: CFPX-104; Length: 5mm; Width: 3.2mm; Height: 1mm; Frequency: 20MHz; Frequency Tolerance: +/-20ppm